# EAGLE design FlightController (EAGLE 7.7.0)
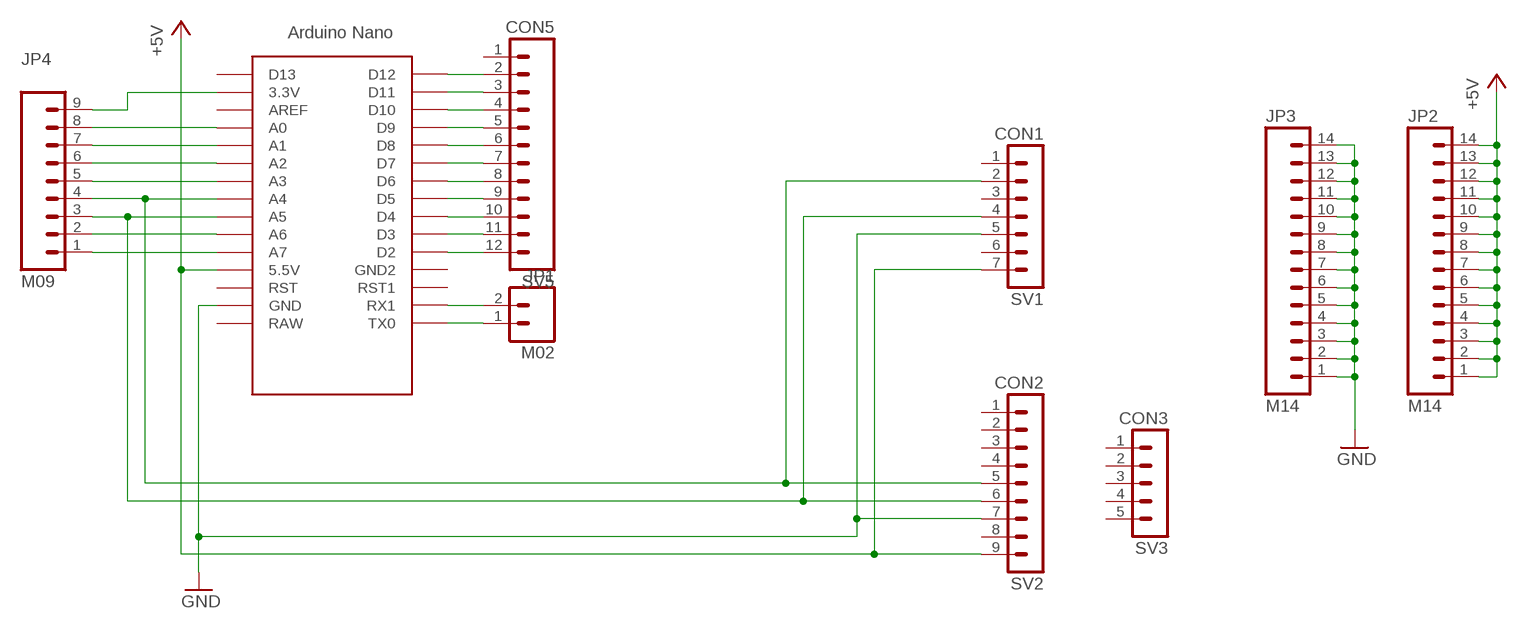
[diagram p0: schematic, sheet 1]

## Parts
JP1  M02  M02PTH  [1X02]
JP2  M14  [1X14]
JP3  M14  [1X14]
JP4  M09  [1X09]
SV1  CON1  MA07-1  [MA07-1]
SV2  CON2  MA09-1  [MA09-1]
SV3  CON3  MA05-1  [MA05-1]
SV5  CON5  M12PTH  [1X12]
U$1  NANO  [NANO]

## Nets
+5V: JP2.1 JP2.2 JP2.3 JP2.4 JP2.5 JP2.6 JP2.7 JP2.8 JP2.9 JP2.10 JP2.11 JP2.12 JP2.13 JP2.14 SV1.7 SV2.9 U$1.5V(5.5V)
GND: JP3.1 JP3.2 JP3.3 JP3.4 JP3.5 JP3.6 JP3.7 JP3.8 JP3.9 JP3.10 JP3.11 JP3.12 JP3.13 JP3.14 SV1.5 SV2.7 U$1.GND
N$1: JP4.4 SV1.2 SV2.5 U$1.A4
N$2: JP4.3 SV1.4 SV2.6 U$1.A5
N$3: SV5.12 U$1.D2
N$4: SV5.11 U$1.D3
N$5: SV5.10 U$1.D4
N$6: SV5.9 U$1.D5
N$7: SV5.8 U$1.D6
N$8: SV5.7 U$1.D7
N$9: SV5.6 U$1.D8
N$10: SV5.5 U$1.D9
N$11: SV5.4 U$1.D10
N$12: SV5.3 U$1.D11
N$13: SV5.2 U$1.D12
N$14: JP1.2 U$1.RX1
N$15: JP1.1 U$1.TX0
N$16: JP4.1 U$1.A7
N$17: JP4.2 U$1.A6
N$18: JP4.5 U$1.A3
N$19: JP4.6 U$1.A2
N$20: JP4.7 U$1.A1
N$21: JP4.8 U$1.A0
N$22: JP4.9 U$1.3.3V
Unconnected: SV1.1 SV1.3 SV1.6 SV2.1 SV2.2 SV2.3 SV2.4 SV2.8 SV3.1 SV3.2 SV3.3 SV3.4 SV3.5 SV5.1 U$1.AREF U$1.D13 U$1.GND1(GND2) U$1.ICSP1 U$1.ICSP2 U$1.ICSP3 U$1.ICSP4 U$1.ICSP5 U$1.ICSP6 U$1.RAW U$1.RST U$1.RST1

## Library data of the parts
JP1 = SparkFun:M02: Header 2 Standard 2-pin 0.1" header. Use with straight break away headers (SKU : PRT-00116), right angle break away headers (PRT-00553), swiss pins (PRT-00743), machine pins (PRT-00117), and female headers (PRT-00115). Molex polarized connector foot print use with SKU : PRT-08233 with associated crimp pins and housings.
JP2 JP3 = SparkFun:M14: Header 14 Standard 14-pin 0.1" header. Use with straight break away headers (SKU : PRT-00116), right angle break away headers (PRT-00553), swiss pins (PRT-00743), machine pins (PRT-00117), and female headers (PRT-00115).
JP4 = SparkFun:M09: Header 9 Standard 9-pin 0.1" header. Use with straight break away headers (SKU : PRT-00116), right angle break away headers (PRT-00553), swiss pins (PRT-00743), machine pins (PRT-00117), and female headers (PRT-00115).
SV1 = con-lstb:MA07-1: PIN HEADER; OC_FARNELL: unknown; OC_NEWARK: unknown
SV2 = con-lstb:MA09-1: PIN HEADER; OC_FARNELL: unknown; OC_NEWARK: unknown
SV3 = con-lstb:MA05-1: PIN HEADER; OC_FARNELL: unknown; OC_NEWARK: unknown
SV5 = SparkFun:M12: Header 12 Standard 12-pin 0.1" header. Use with straight break away headers (SKU : PRT-00116), right angle break away headers (PRT-00553), swiss pins (PRT-00743), machine pins (PRT-00117), and female headers (PRT-00115).
U$1 = Arduino-clone:NANO: Arduino Nano

## Board
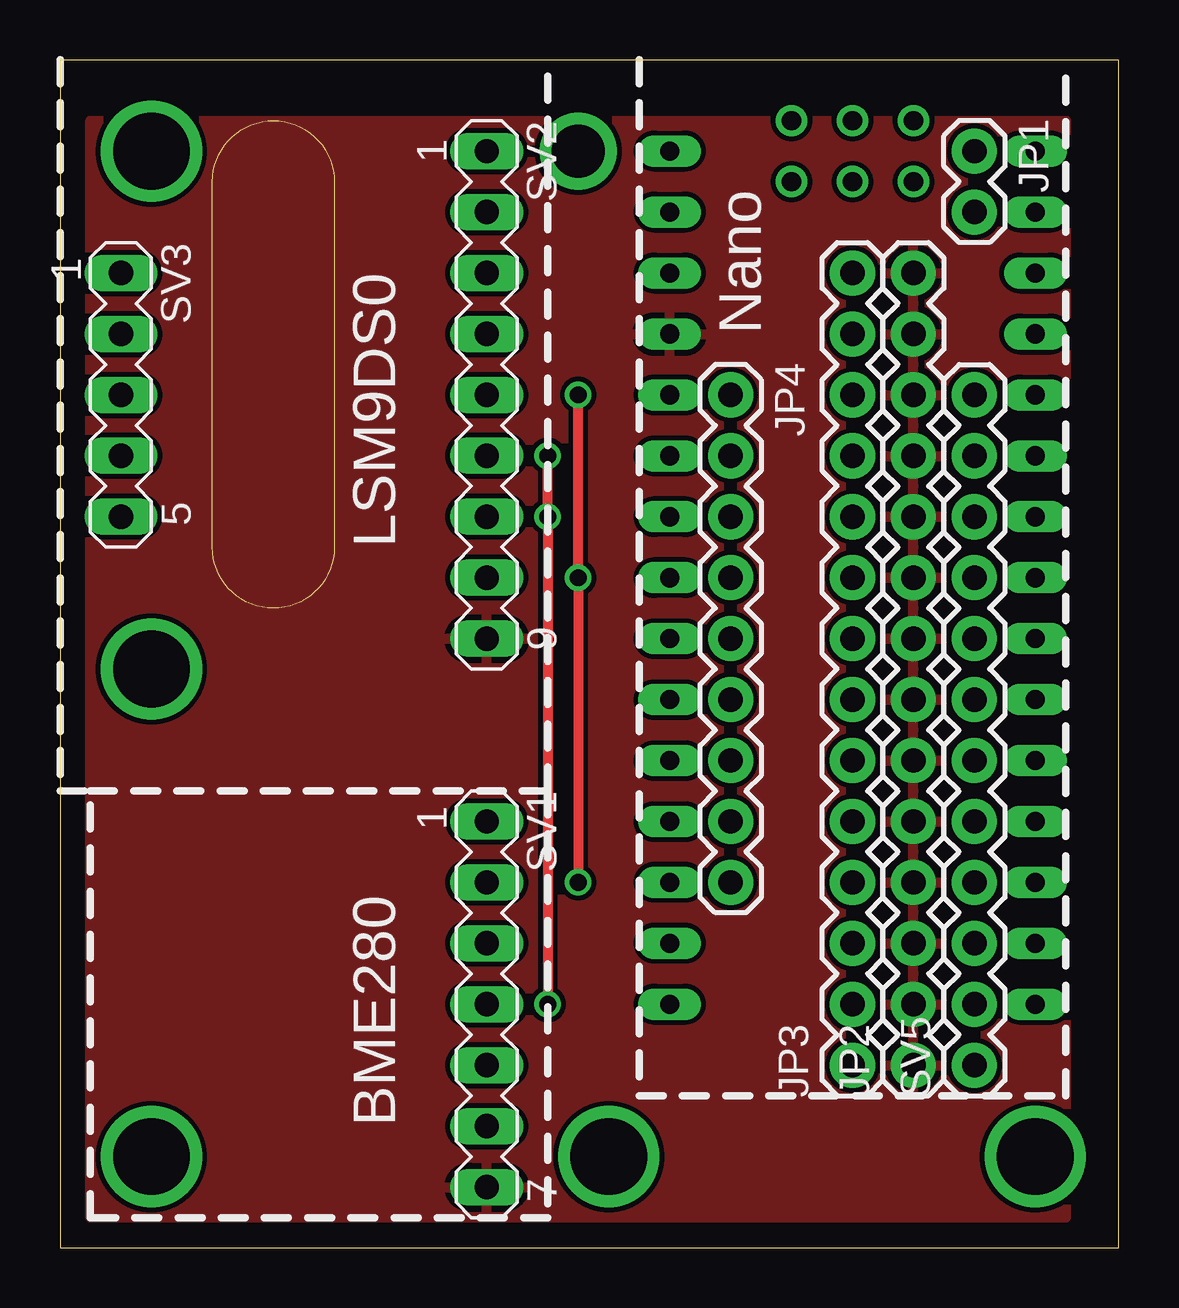
[diagram p1: board, top side]
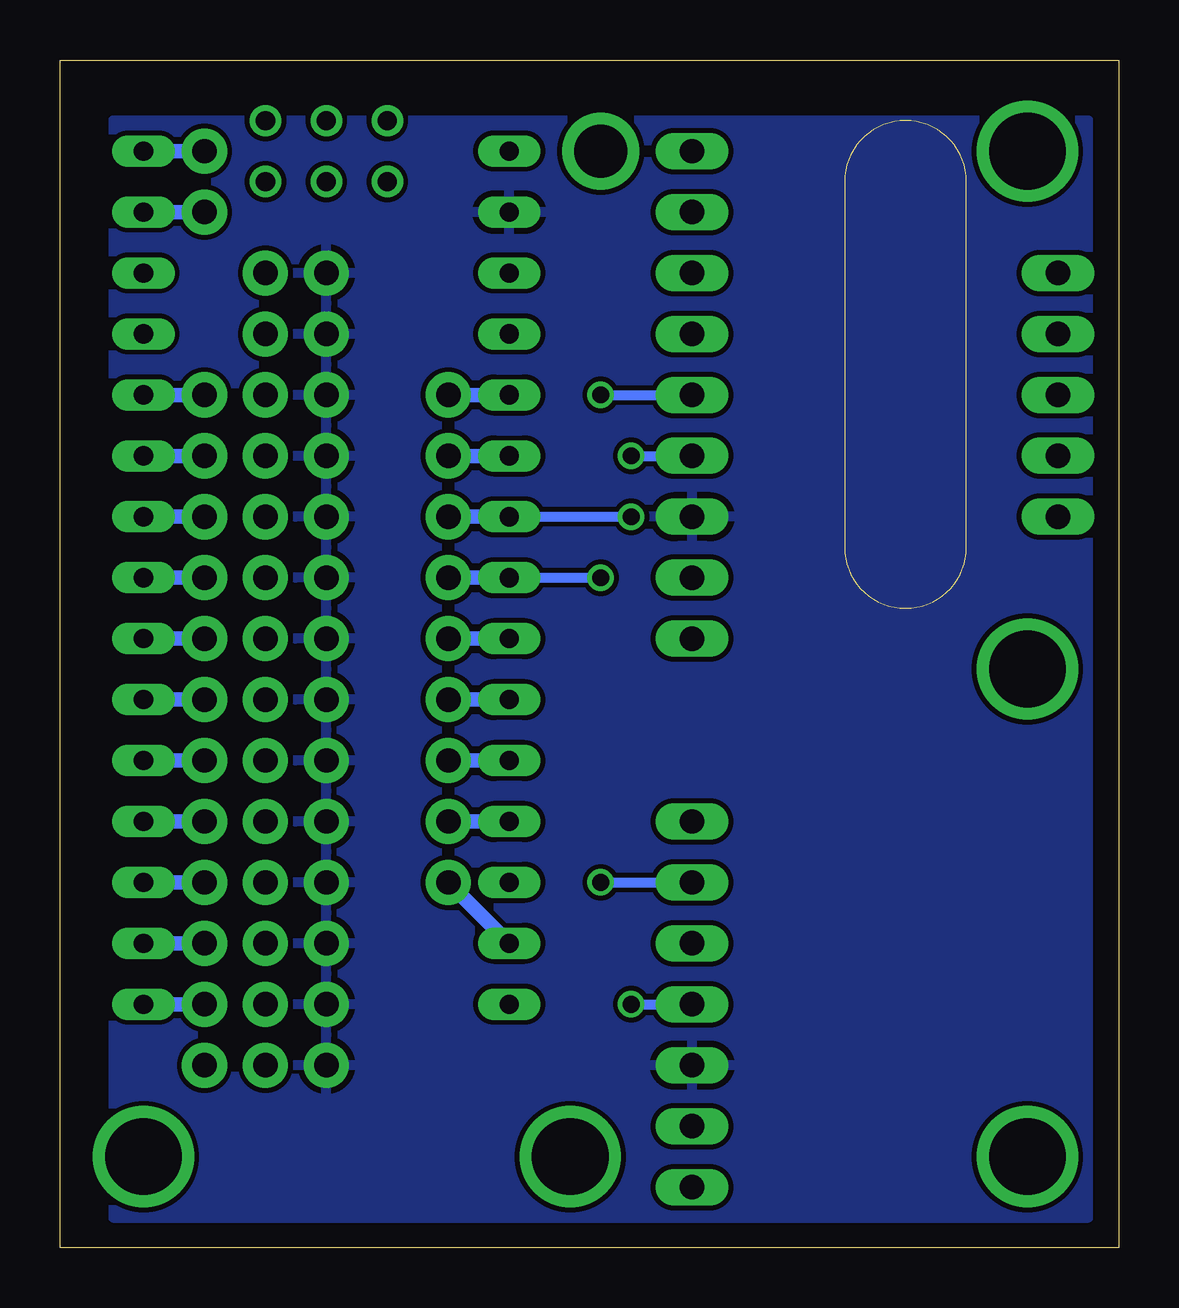
[diagram p2: board, bottom side, seen from below]

Size 44.12 x 49.52 mm. Coordinates in mm from the lower left corner, seen from the top.
Outline: 0,0 44.12,0 44.12,49.52 0,49.52 0,0
Copper layers (1*16): Top 0.035mm / dielectric 1.5mm / Bottom 0.035mm
Design rules "default": minimum track width 10mil, minimum drill 24mil, track to track 8mil, track to pad 8mil, pad to pad 8mil, via to via 8mil, smd to smd 8mil, copper to edge 40mil, drill to drill 8mil, minimum pad ring 10mil, minimum via ring 8mil, stop-mask expansion 4mil, vias tented up to drill 0mil, thermal gap 10mil
Milling: 6 lines

### Footprints (pad centres in the part's own frame; a part is rotated, then mirrored left to right if it is on the bottom)
1X02 = drill 1.016 pad 1.88: 1 0,0; 2 2.54,0
1X14 = drill 1.016 pad 1.88: 1 0,0; 2 2.54,0; 3 5.08,0; 4 7.62,0; 5 10.16,0; 6 12.7,0; 7 15.24,0; 8 17.78,0; 9 20.32,0; 10 22.86,0; 11 25.4,0; 12 27.94,0; 13 30.48,0; 14 33.02,0
1X09 = drill 1.016 pad 1.88: 1 0,0; 2 2.54,0; 3 5.08,0; 4 7.62,0; 5 10.16,0; 6 12.7,0; 7 15.24,0; 8 17.78,0; 9 20.32,0
MA07-1 = drill 1.016 long: 1 -7.62,0; 2 -5.08,0; 3 -2.54,0; 4 0,0; 5 2.54,0; 6 5.08,0; 7 7.62,0
MA09-1 = drill 1.016 long: 1 -10.16,0; 2 -7.62,0; 3 -5.08,0; 4 -2.54,0; 5 0,0; 6 2.54,0; 7 5.08,0; 8 7.62,0; 9 10.16,0
MA05-1 = drill 1.016 long: 1 -5.08,0; 2 -2.54,0; 3 0,0; 4 2.54,0; 5 5.08,0
1X12 = drill 1.016 pad 1.88: 1 0,0; 2 2.54,0; 3 5.08,0; 4 7.62,0; 5 10.16,0; 6 12.7,0; 7 15.24,0; 8 17.78,0; 9 20.32,0; 10 22.86,0; 11 25.4,0; 12 27.94,0
NANO = drill 0.8 long: 3.3V -10.16,24.13; 5V -10.16,-1.27; A0 -10.16,19.05; A1 -10.16,16.51; A2 -10.16,13.97; A3 -10.16,11.43; A4 -10.16,8.89; A5 -10.16,6.35; A6 -10.16,3.81; A7 -10.16,1.27; AREF -10.16,21.59; D2 5.08,1.27; D3 5.08,3.81; D4 5.08,6.35; D5 5.08,8.89; D6 5.08,11.43; D7 5.08,13.97; D8 5.08,16.51; D9 5.08,19.05; D10 5.08,21.59; D11 5.08,24.13; D12 5.08,26.67; D13 -10.16,26.67; GND -10.16,-6.35; GND1 5.08,-1.27; RAW -10.16,-8.89; RST -10.16,-3.81; RST1 5.08,-3.81; RX1 5.08,-6.35; TX0 5.08,-8.89 | drill 0.8: ICSP1 -5.08,-10.16; ICSP2 -5.08,-7.62; ICSP3 -2.54,-10.16; ICSP4 -2.54,-7.62; ICSP5 0,-10.16; ICSP6 0,-7.62

### Placement (x,y rotation side)
JP1  38.1,45.72 270 top
JP2  35.56,7.62 90 top
JP3  33.02,7.62 90 top
JP4  27.94,35.56 270 top
SV1  17.78,10.16 270 top
SV2  17.78,35.56 270 top
SV3  2.54,35.56 270 top
SV5  38.1,7.62 90 top
U$1  35.56,36.83 180 bottom

### Tracks (layer width: path | path; a pad name or v marks a point on that pad's centre or on a via)
+5V
  pour Top: 1.27,46.99 41.91,46.99 41.91,1.27 1.27,1.27
  pour Top: 12.7,5.08 12.7,27.94 5.08,27.94 5.08,5.08
GND
  pour Bottom: 1.27,46.99 41.91,46.99 41.91,1.27 1.27,1.27
N$1  (via drill 0.7)
  Top 0.406: v21.59,35.56 v21.59,27.94 v21.59,15.24
  Bottom 0.406: v21.59,35.56 SV2.5 | v21.59,15.24 SV1.2 | U$1.A4 v21.59,27.94
  Bottom 0.61: U$1.A4 JP4.4
N$2  (via drill 0.7)
  Top 0.406: v20.32,33.02 v20.32,30.48 v20.32,10.16
  Bottom 0.406: v20.32,33.02 SV2.6 | v20.32,10.16 SV1.4 | U$1.A5 v20.32,30.48
  Bottom 0.61: JP4.3 U$1.A5
N$3
  Bottom 0.61: SV5.12 U$1.D2
N$4
  Bottom 0.61: U$1.D3 SV5.11
N$5
  Bottom 0.61: SV5.10 U$1.D4
N$6
  Bottom 0.61: U$1.D5 SV5.9
N$7
  Bottom 0.61: SV5.8 U$1.D6
N$8
  Bottom 0.61: U$1.D7 SV5.7
N$9
  Bottom 0.61: SV5.6 U$1.D8
N$10
  Bottom 0.61: U$1.D9 SV5.5
N$11
  Bottom 0.61: SV5.4 U$1.D10
N$12
  Bottom 0.61: U$1.D11 SV5.3
N$13
  Bottom 0.61: SV5.2 U$1.D12
N$14
  Bottom 0.61: U$1.RX1 JP1.2
N$15
  Bottom 0.61: JP1.1 U$1.TX0
N$16
  Bottom 0.61: JP4.1 U$1.A7
N$17
  Bottom 0.61: U$1.A6 JP4.2
N$18
  Bottom 0.61: JP4.5 U$1.A3
N$19
  Bottom 0.61: U$1.A2 JP4.6
N$20
  Bottom 0.61: JP4.7 U$1.A1
N$21
  Bottom 0.61: U$1.A0 JP4.8
N$22
  Bottom 0.61: JP4.9 U$1.3.3V
N$23  (via drill 3.2)
  other vias: 3.81,45.72
N$24  (via drill 3.2)
  other vias: 3.81,3.81
N$25  (via drill 3.2)
  other vias: 40.64,3.81
N$26  (via drill 3.2)
  other vias: 22.86,3.81
N$27  (via drill 3.2)
  other vias: 3.81,24.13
N$28  (via drill 2.2)
  other vias: 21.59,45.72

### Text on the board
tNames: Nano | LSM9DS0 | BME280
tRestrict: Drone MultiWii / FlightController / v1.1 2018????ZUS